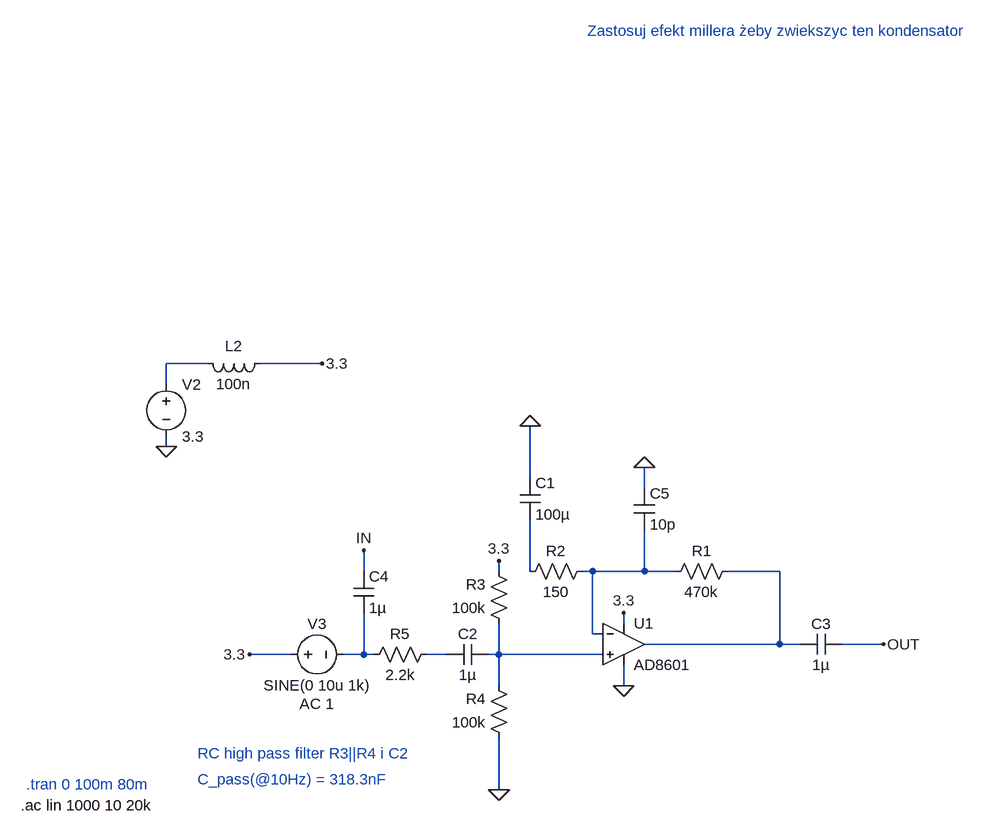
[diagram p0: schematic micAmp.asc]
micAmp.asc, the LTspice schematic file:
Version 4
SHEET 1 964 680
WIRE -336 -288 -400 -288
WIRE -160 -288 -256 -288
WIRE -400 -256 -400 -288
WIRE -400 -160 -400 -176
WIRE 160 -112 160 -192
WIRE 336 -96 336 -128
WIRE -96 32 -96 0
WIRE 112 32 112 16
WIRE 160 32 160 -48
WIRE 256 32 240 32
WIRE 336 32 336 -32
WIRE 336 32 256 32
WIRE 384 32 336 32
WIRE 544 32 464 32
WIRE 304 112 304 96
WIRE 256 128 256 32
WIRE 272 128 256 128
WIRE 544 144 544 32
WIRE 544 144 336 144
WIRE 576 144 544 144
WIRE 704 144 640 144
WIRE -208 160 -272 160
WIRE -96 160 -96 96
WIRE -96 160 -128 160
WIRE -80 160 -96 160
WIRE 32 160 0 160
WIRE 112 160 112 112
WIRE 112 160 96 160
WIRE 272 160 112 160
WIRE 112 208 112 160
WIRE 304 208 304 176
WIRE 112 368 112 288
FLAG 112 368 0
FLAG -400 -160 0
FLAG -160 -288 3.3
FLAG 112 16 3.3
FLAG 304 96 3.3
FLAG 304 208 0
FLAG -272 160 3.3
FLAG 704 144 OUT
FLAG -96 0 IN
FLAG 160 -192 0
FLAG 336 -128 0
SYMBOL OpAmps\\AD8601 304 80 R0
SYMATTR InstName U1
SYMBOL res 480 16 R90
WINDOW 0 0 56 VBottom 2
WINDOW 3 32 56 VTop 2
SYMATTR InstName R1
SYMATTR Value 470k
SYMBOL res 256 16 R90
WINDOW 0 0 56 VBottom 2
WINDOW 3 32 56 VTop 2
SYMATTR InstName R2
SYMATTR Value 150
SYMBOL res 128 128 R180
WINDOW 0 36 76 Left 2
WINDOW 3 36 40 Left 2
SYMATTR InstName R3
SYMATTR Value 100k
SYMBOL res 128 304 R180
WINDOW 0 36 76 Left 2
WINDOW 3 36 40 Left 2
SYMATTR InstName R4
SYMATTR Value 100k
SYMBOL voltage -400 -272 R0
WINDOW 123 0 0 Left 0
WINDOW 39 0 0 Left 0
SYMATTR InstName V2
SYMATTR Value 3.3
SYMBOL ind -240 -304 R90
WINDOW 0 5 56 VBottom 2
WINDOW 3 32 56 VTop 2
SYMATTR InstName L2
SYMATTR Value 100n
SYMBOL cap 96 144 R90
WINDOW 0 0 32 VBottom 2
WINDOW 3 32 32 VTop 2
SYMATTR InstName C2
SYMATTR Value 1µ
SYMBOL res -96 176 R270
WINDOW 0 32 56 VTop 2
WINDOW 3 0 56 VBottom 2
SYMATTR InstName R5
SYMATTR Value 2.2k
SYMBOL voltage -224 160 R270
WINDOW 0 32 56 VTop 2
WINDOW 3 -32 56 VBottom 2
WINDOW 123 -60 56 VBottom 2
WINDOW 39 0 0 Left 0
SYMATTR InstName V3
SYMATTR Value SINE(0 10u 1k)
SYMATTR Value2 AC 1
SYMBOL cap 640 128 R90
WINDOW 0 0 32 VBottom 2
WINDOW 3 32 32 VTop 2
SYMATTR InstName C3
SYMATTR Value 1µ
SYMBOL cap -112 32 R0
SYMATTR InstName C4
SYMATTR Value 1µ
SYMBOL cap 144 -112 R0
SYMATTR InstName C1
SYMATTR Value 100µ
SYMBOL cap 320 -96 R0
SYMATTR InstName C5
SYMATTR Value 10p
TEXT -616 360 Left 2 ;.tran 0 100m 80m
TEXT -624 392 Left 2 !.ac lin 1000 10 20k
TEXT -352 312 Left 2 ;RC high pass filter R3||R4 i C2
TEXT -352 352 Left 2 ;C_pass(@10Hz) = 318.3nF
TEXT 248 -800 Left 2 ;Zastosuj efekt millera żeby zwiekszyc ten kondensator

The netlist it stands for:
* micAmp.asc
XU1 N007 N003 3.3 0 N004 AD8601  ; pins In+ In- V+ V- OUT
R1 N004 N003 470k
R2 N003 N002 150
R3 N007 3.3 100k
R4 0 N007 100k
V2 N001 0 3.3
L2 3.3 N001 100n
C2 N007 N006 1µ
R5 N005 N006 2.2k
V3 3.3 N005 SINE(0 10u 1k) AC 1
C3 OUT N004 1µ
C4 IN N005 1µ
C1 0 N002 100µ
C5 0 N003 10p
* .tran 0 100m 80m
.ac lin 1000 10 20k
* RC high pass filter R3||R4 i C2
* C_pass(@10Hz) = 318.3nF
* Zastosuj efekt millera żeby zwiekszyc ten kondensator
.backanno
.end